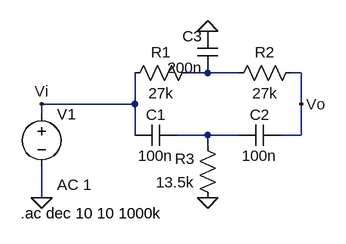
[diagram p0: schematic Figure1Notch.asc]
Figure1Notch.asc, the LTspice schematic file:
Version 4
SHEET 1 880 680
WIRE 272 64 240 64
WIRE 320 64 272 64
WIRE 416 64 400 64
WIRE 160 112 160 64
WIRE 160 112 16 112
WIRE 416 112 416 64
WIRE 16 128 16 112
WIRE 160 160 160 112
WIRE 272 160 224 160
WIRE 320 160 272 160
WIRE 416 160 416 112
WIRE 416 160 384 160
WIRE 272 176 272 160
WIRE 16 256 16 208
FLAG 16 256 0
FLAG 16 112 Vi
FLAG 416 112 Vo
FLAG 272 256 0
FLAG 272 0 0
SYMBOL voltage 16 112 R0
WINDOW 123 24 124 Left 2
WINDOW 39 0 0 Left 0
SYMATTR Value2 AC 1
SYMATTR InstName V1
SYMATTR Value ""
SYMBOL cap 224 144 R90
WINDOW 0 0 32 VBottom 2
WINDOW 3 32 32 VTop 2
SYMATTR InstName C1
SYMATTR Value 100n
SYMBOL cap 384 144 R90
WINDOW 0 0 32 VBottom 2
WINDOW 3 32 32 VTop 2
SYMATTR InstName C2
SYMATTR Value 100n
SYMBOL cap 288 64 R180
WINDOW 0 24 56 Left 2
WINDOW 3 24 8 Left 2
SYMATTR InstName C3
SYMATTR Value 200n
SYMBOL res 256 48 R90
WINDOW 0 0 56 VBottom 2
WINDOW 3 32 56 VTop 2
SYMATTR InstName R1
SYMATTR Value 27k
SYMBOL res 416 48 R90
WINDOW 0 0 56 VBottom 2
WINDOW 3 32 56 VTop 2
SYMATTR InstName R2
SYMATTR Value 27k
SYMBOL res 288 272 R180
WINDOW 0 36 76 Left 2
WINDOW 3 36 40 Left 2
SYMATTR InstName R3
SYMATTR Value 13.5k
TEXT -16 280 Left 2 !.ac dec 10 10 1000k

The netlist it stands for:
* Figure1Notch.asc
V1 Vi 0 AC 1
C1 N002 Vi 100n
C2 Vo N002 100n
C3 N001 0 200n
R1 N001 Vi 27k
R2 Vo N001 27k
R3 0 N002 13.5k
.ac dec 10 10 1000k
.backanno
.end